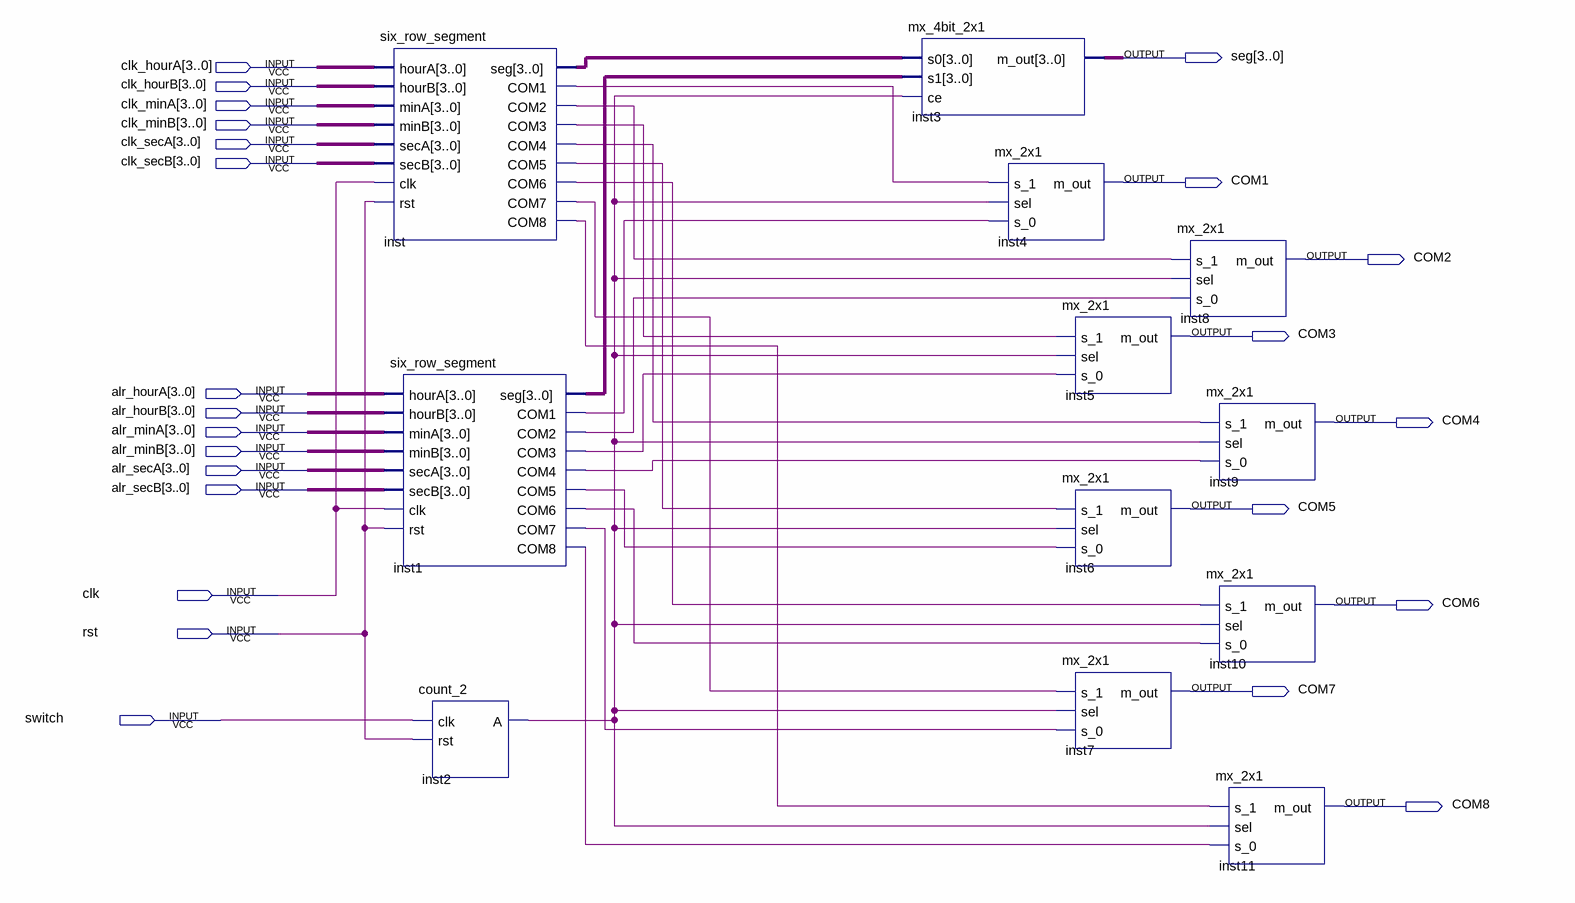
[diagram p0: schematic sheet]
// Quartus schematic switch_six_row_segment.bdf as structural Verilog: 12 symbols, 24 pins
module switch_six_row_segment (
  input  [3:0] clk_hourA,
  input  [3:0] clk_hourB,
  input  [3:0] clk_minA,
  input  [3:0] clk_minB,
  input  [3:0] clk_secA,
  input  [3:0] clk_secB,
  input  [3:0] alr_hourA,
  input  [3:0] alr_hourB,
  input  [3:0] alr_minA,
  input  [3:0] alr_minB,
  input  [3:0] alr_secA,
  input  [3:0] alr_secB,
  input  clk,
  input  rst,
  input  switch,
  output [3:0] seg,
  output COM1,
  output COM2,
  output COM3,
  output COM4,
  output COM5,
  output COM6,
  output COM7,
  output COM8
);

  wire inst1_com1, inst1_com2, inst1_com3, inst1_com4, inst1_com5, inst1_com6, inst1_com7, inst1_com8,
       inst2_a, inst_com1, inst_com2, inst_com3, inst_com4, inst_com5, inst_com6, inst_com7, inst_com8;
  wire [3:0] inst1_seg, inst_seg;

  six_row_segment inst (
    .hourA(clk_hourA), .hourB(clk_hourB), .minA(clk_minA), .minB(clk_minB), .secA(clk_secA), .secB(clk_secB),
    .clk(clk), .rst(rst), .seg(inst_seg), .COM1(inst_com1), .COM2(inst_com2), .COM3(inst_com3),
    .COM4(inst_com4), .COM5(inst_com5), .COM6(inst_com6), .COM7(inst_com7), .COM8(inst_com8));
  six_row_segment inst1 (
    .hourA(alr_hourA), .hourB(alr_hourB), .minA(alr_minA), .minB(alr_minB), .secA(alr_secA), .secB(alr_secB),
    .clk(clk), .rst(rst), .seg(inst1_seg), .COM1(inst1_com1), .COM2(inst1_com2), .COM3(inst1_com3),
    .COM4(inst1_com4), .COM5(inst1_com5), .COM6(inst1_com6), .COM7(inst1_com7), .COM8(inst1_com8));
  count_2 inst2 (.clk(switch), .rst(rst), .A(inst2_a));
  mx_4bit_2x1 inst3 (.s0(inst_seg), .s1(inst1_seg), .ce(inst2_a), .m_out(seg));
  mx_2x1 inst4 (.s_1(inst_com1), .sel(inst2_a), .s_0(inst1_com1), .m_out(COM1));
  mx_2x1 inst5 (.s_1(inst_com3), .sel(inst2_a), .s_0(inst1_com3), .m_out(COM3));
  mx_2x1 inst6 (.s_1(inst_com5), .sel(inst2_a), .s_0(inst1_com5), .m_out(COM5));
  mx_2x1 inst7 (.s_1(inst_com7), .sel(inst2_a), .s_0(inst1_com7), .m_out(COM7));
  mx_2x1 inst8 (.s_1(inst_com2), .sel(inst2_a), .s_0(inst1_com2), .m_out(COM2));
  mx_2x1 inst9 (.s_1(inst_com4), .sel(inst2_a), .s_0(inst1_com4), .m_out(COM4));
  mx_2x1 inst10 (.s_1(inst_com6), .sel(inst2_a), .s_0(inst1_com6), .m_out(COM6));
  mx_2x1 inst11 (.s_1(inst_com8), .sel(inst2_a), .s_0(inst1_com8), .m_out(COM8));
endmodule
